# EAGLE board Sequencer-Memory-V2.0 (EAGLE 9.6.2)
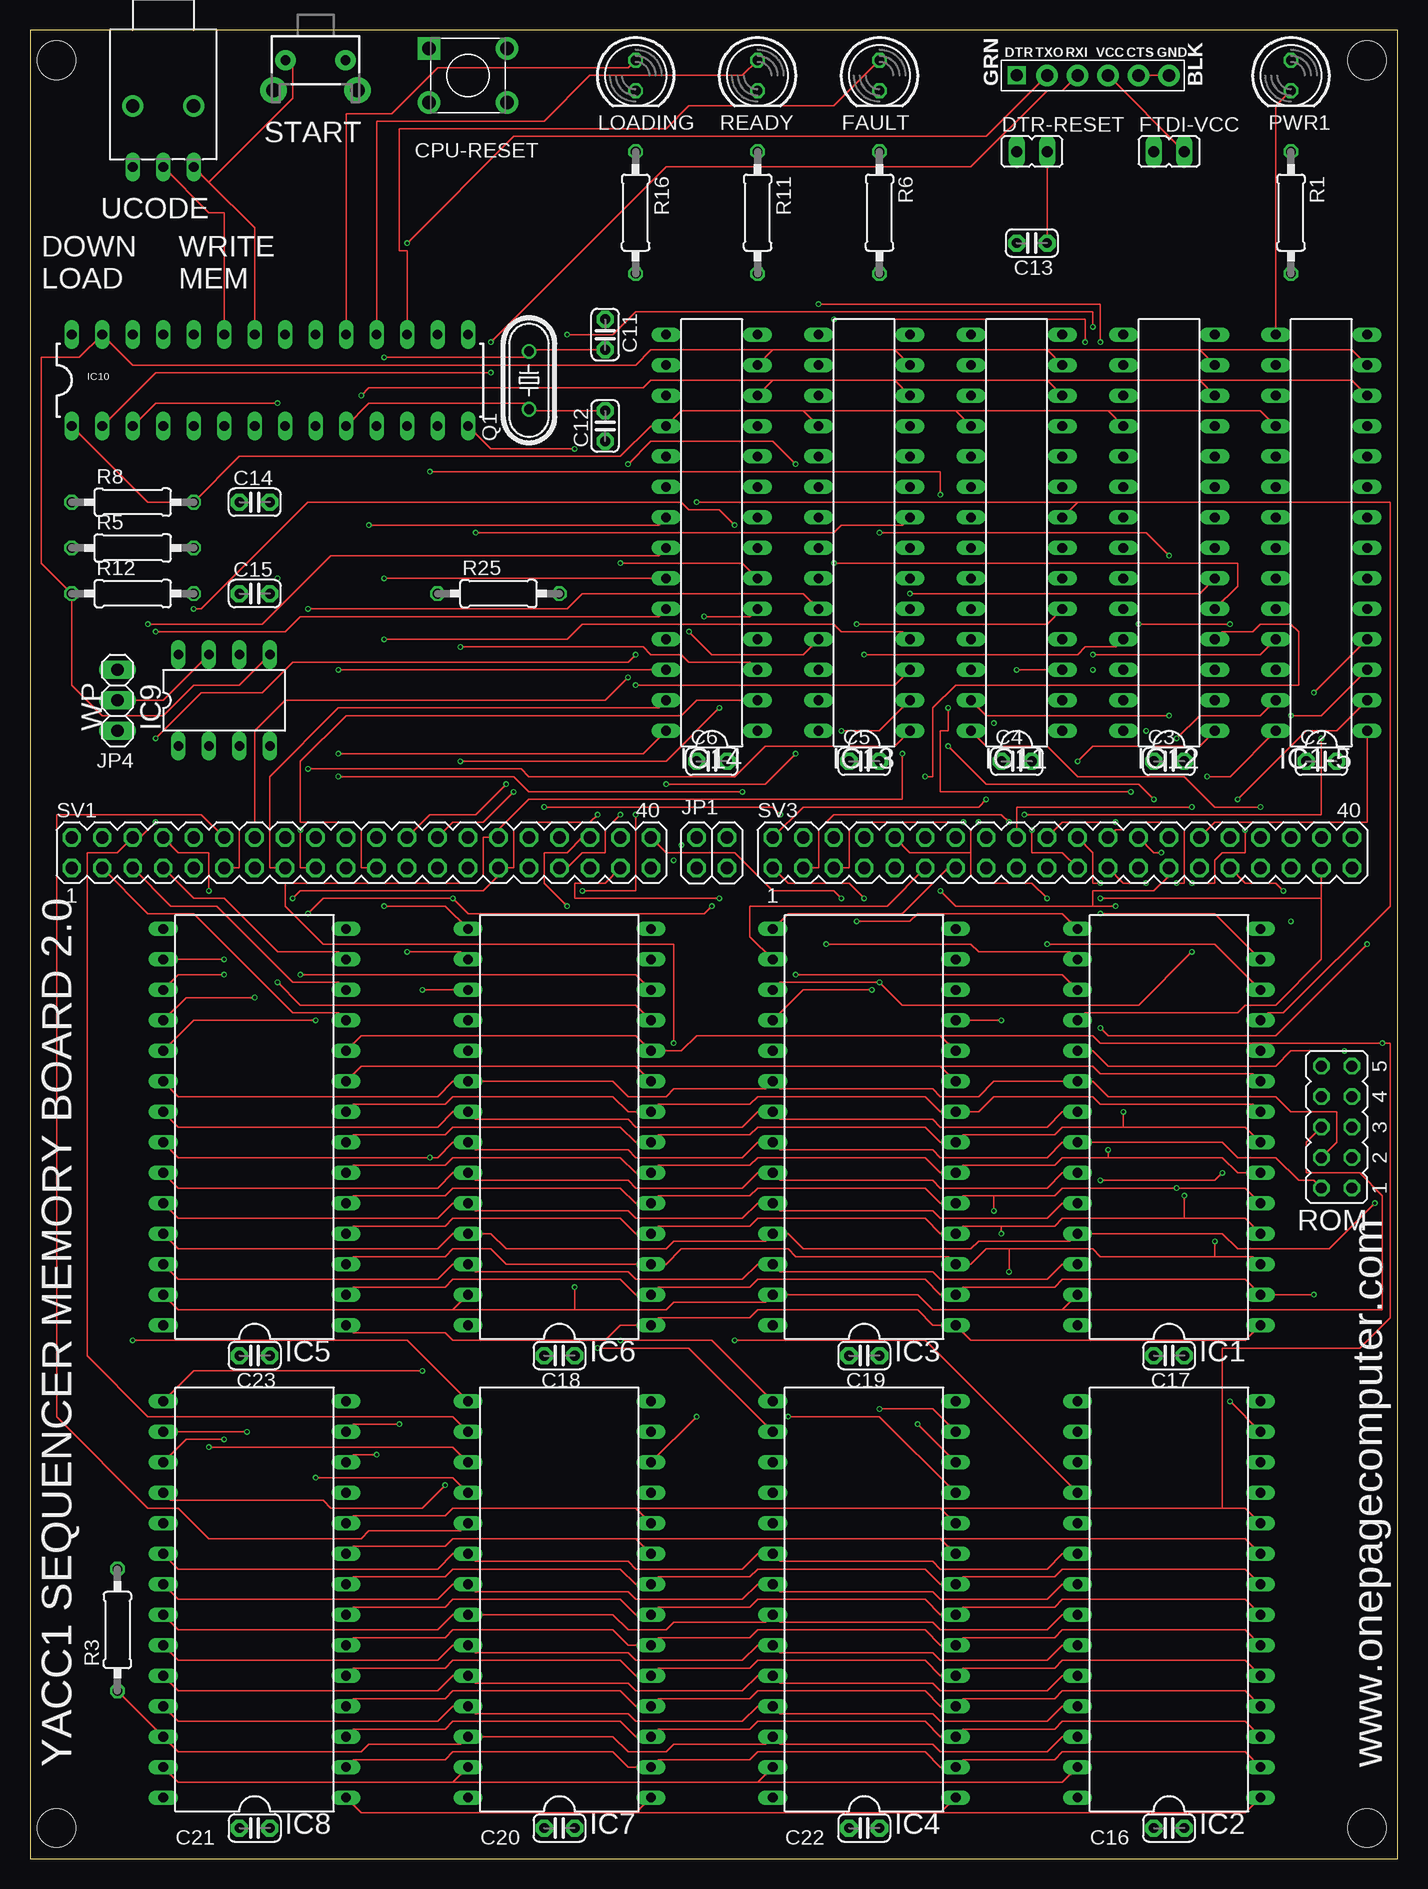
[diagram p4: board, top side]
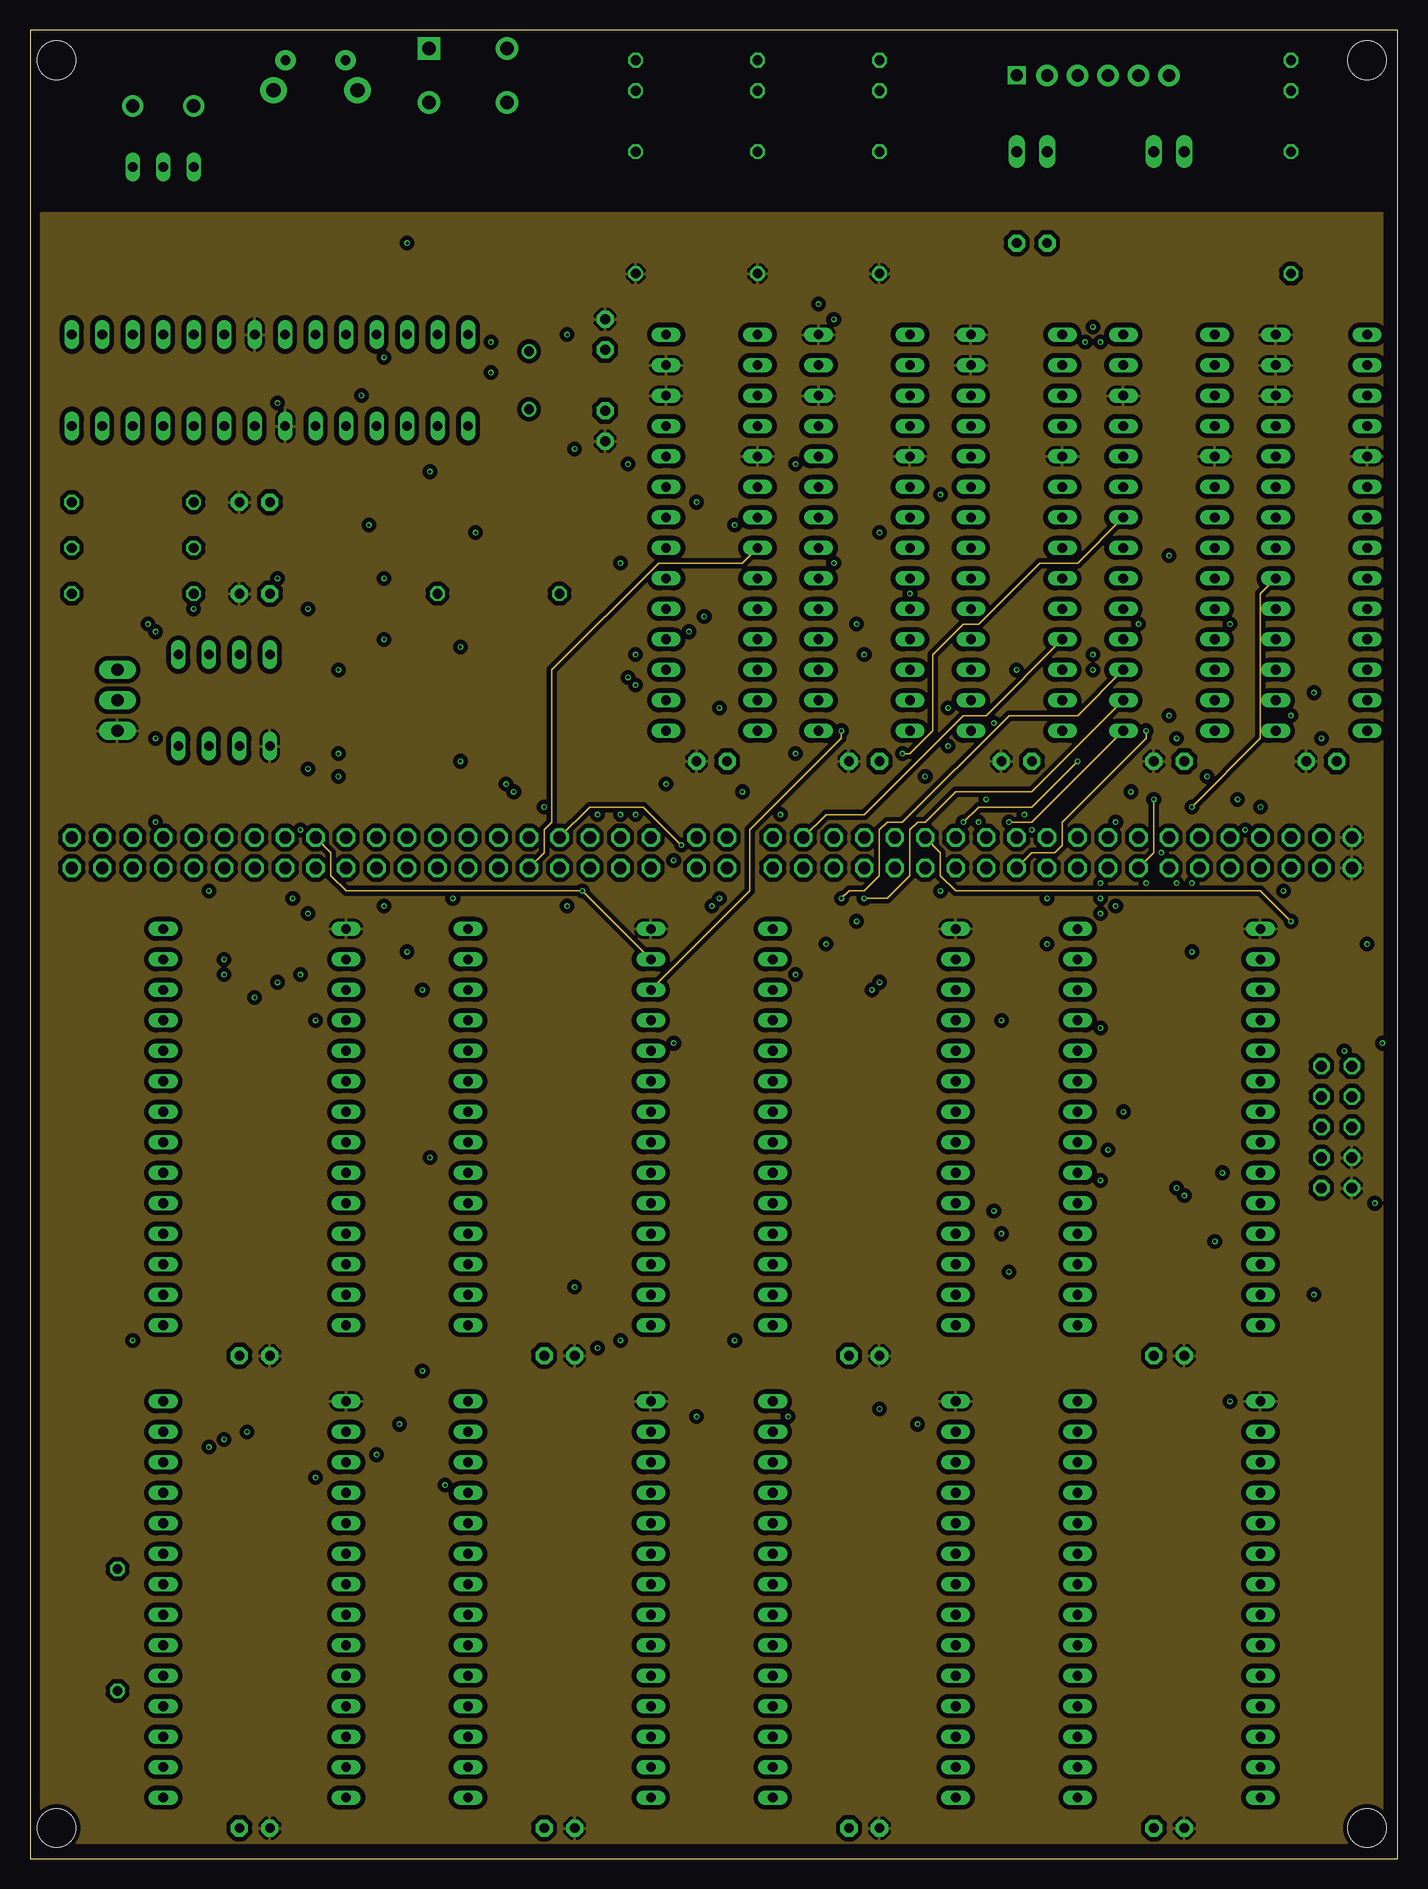
[diagram p5: board, inner layer Route2]
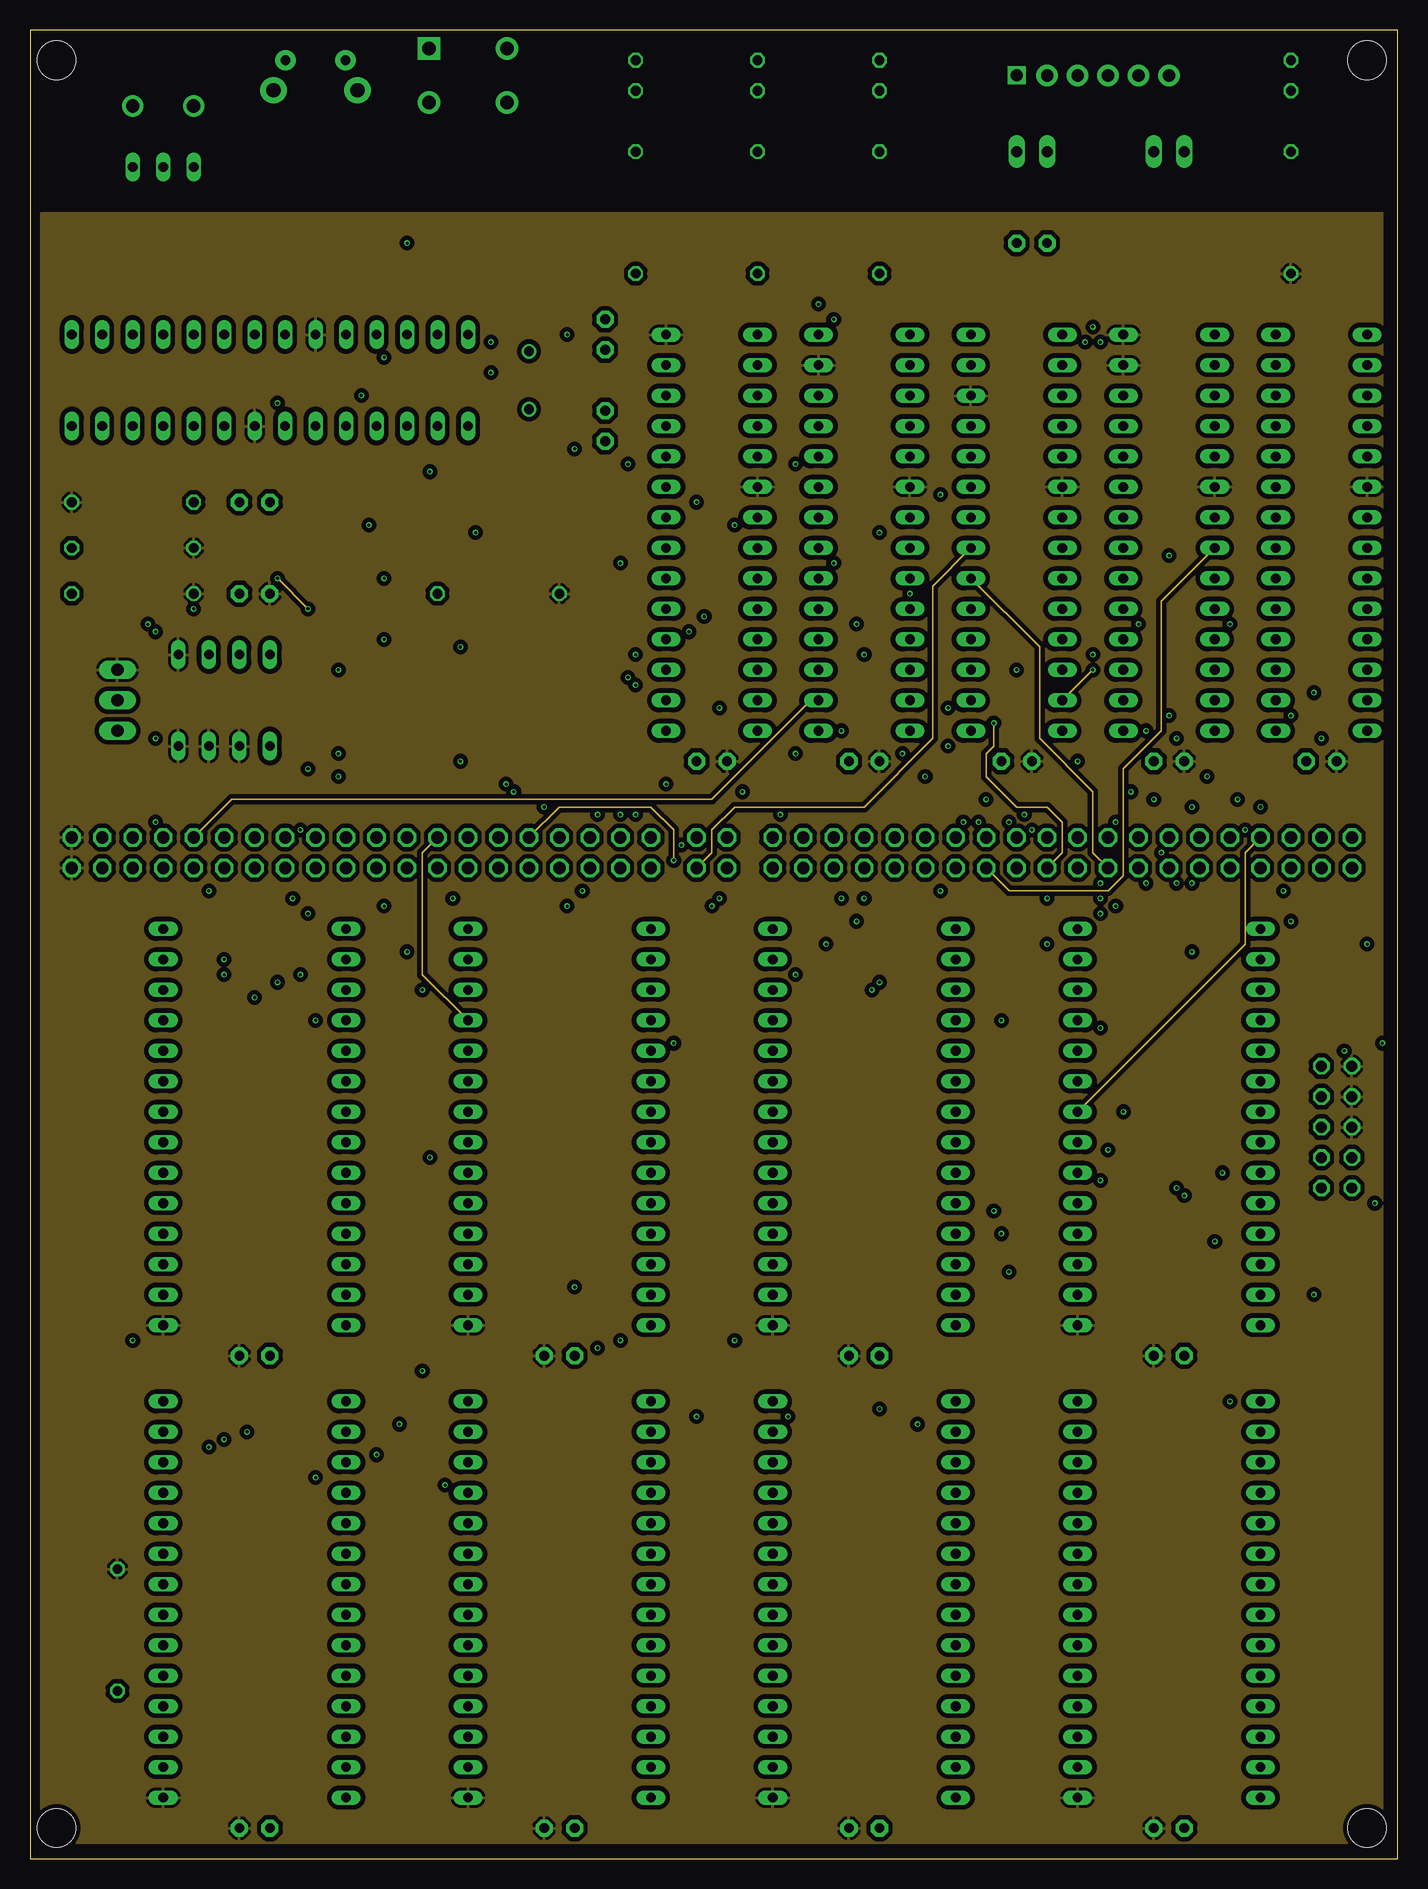
[diagram p6: board, inner layer Route15]
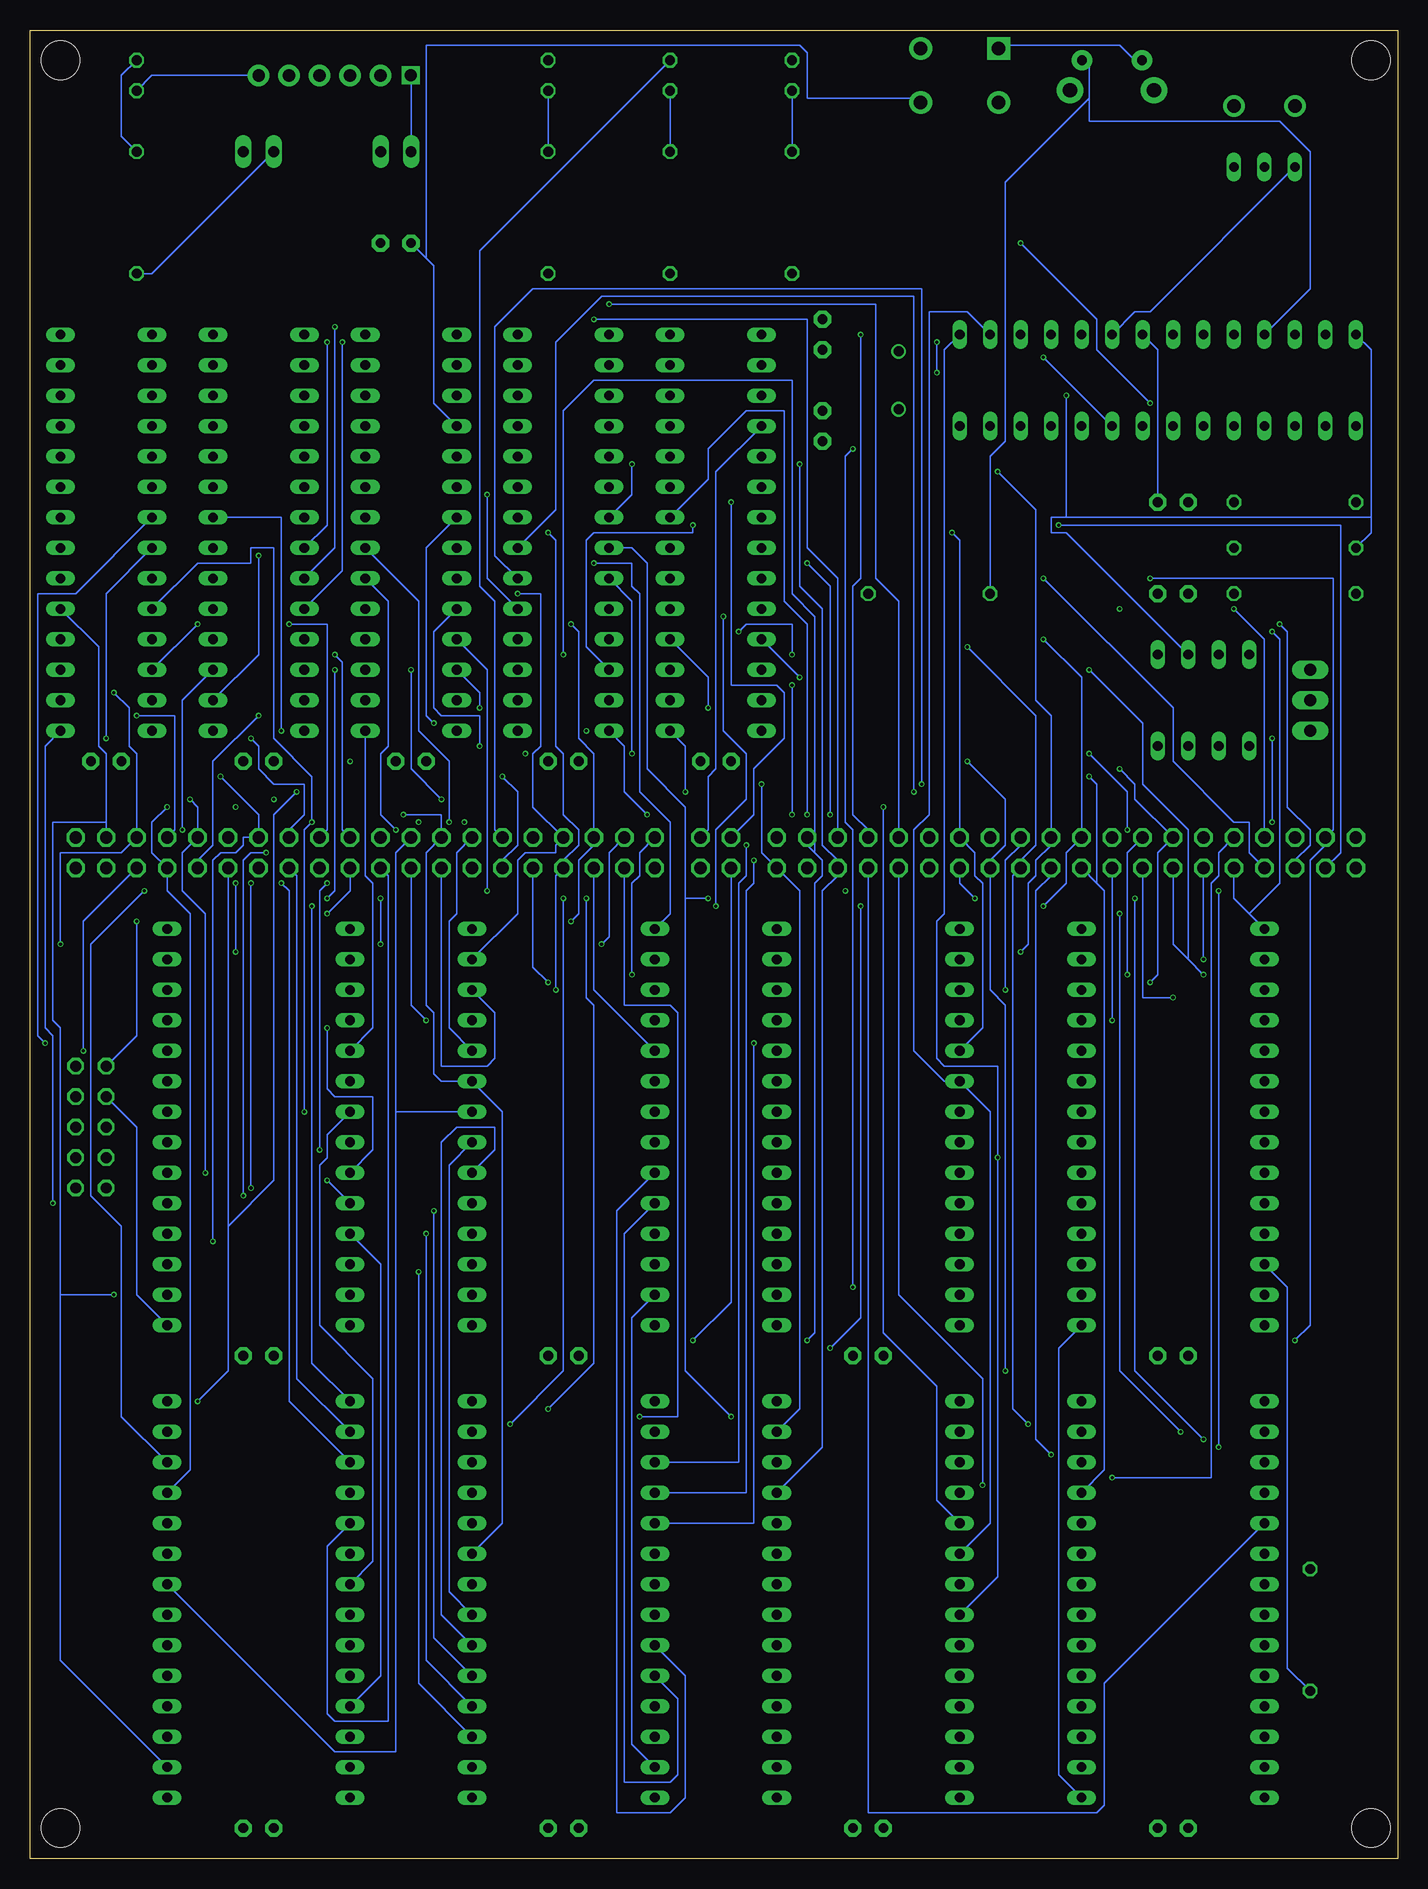
[diagram p7: board, bottom side, seen from below]

Size 113.97 x 152.38 mm. Coordinates in mm from the lower left corner, seen from the top.
Outline: 113.97,0 113.97,152.38 0,152.38 0,0 113.97,0
Copper layers (1*2*15*16): Top 0.035559375mm / dielectric 0.17018125mm / Route2 0.01778125mm / dielectric 47mil / Route15 0.01778125mm / dielectric 0.17018125mm / Bottom 0.035559375mm
Design rules "oshpark-4layer *": minimum track width 5mil, minimum drill 10mil, track to track 15mil, track to pad 10mil, pad to pad 10mil, via to via 5mil, smd to smd 5mil, copper to edge 15mil, drill to drill 6mil, minimum pad ring 4mil, minimum via ring 4mil, stop-mask expansion 2.5mil, vias tented up to drill 0mil, thermal gap 10mil
Holes 3.2 mm at 111.43,2.54 111.43,149.86 2.21,149.86 2.21,2.54

## Footprints (pad centres in the part's own frame; a part is rotated, then mirrored left to right if it is on the bottom)
C025-024X044 = drill 0.813 pad 1.422 octagon: 1 -1.27,0; 2 1.27,0
SW4-6.2X6.2X5.0MM = drill 1.143 pad 1.905 square: 1 -3.25,2.25 | drill 1.143 pad 1.905: 2 -3.25,-2.25; 3 3.25,-2.25; 4 3.25,2.25
JP1 = drill 0.914 long: 1 0,-1.27; 2 0,1.27
LED5MM = drill 0.813 octagon: A -1.27,0; K 1.27,0
DIL28-6 = drill 0.813 long: 1 -16.51,-7.62; 2 -13.97,-7.62; 3 -11.43,-7.62; 4 -8.89,-7.62; 5 -6.35,-7.62; 6 -3.81,-7.62; 7 -1.27,-7.62; 8 1.27,-7.62; 9 3.81,-7.62; 10 6.35,-7.62; 11 8.89,-7.62; 12 11.43,-7.62; 13 13.97,-7.62; 14 16.51,-7.62; 15 16.51,7.62; 16 13.97,7.62; 17 11.43,7.62; 18 8.89,7.62; 19 6.35,7.62; 20 3.81,7.62; 21 1.27,7.62; 22 -1.27,7.62; 23 -3.81,7.62; 24 -6.35,7.62; 25 -8.89,7.62; 26 -11.43,7.62; 27 -13.97,7.62; 28 -16.51,7.62
DIL28-3 = drill 0.813 long: 1 -16.51,-3.81; 2 -13.97,-3.81; 3 -11.43,-3.81; 4 -8.89,-3.81; 5 -6.35,-3.81; 6 -3.81,-3.81; 7 -1.27,-3.81; 8 1.27,-3.81; 9 3.81,-3.81; 10 6.35,-3.81; 11 8.89,-3.81; 12 11.43,-3.81; 13 13.97,-3.81; 14 16.51,-3.81; 15 16.51,3.81; 16 13.97,3.81; 17 11.43,3.81; 18 8.89,3.81; 19 6.35,3.81; 20 3.81,3.81; 21 1.27,3.81; 22 -1.27,3.81; 23 -3.81,3.81; 24 -6.35,3.81; 25 -8.89,3.81; 26 -11.43,3.81; 27 -13.97,3.81; 28 -16.51,3.81
DIL8 = drill 0.813 long: 1 -3.81,-3.81; 2 -1.27,-3.81; 3 1.27,-3.81; 4 3.81,-3.81; 5 3.81,3.81; 6 1.27,3.81; 7 -1.27,3.81; 8 -3.81,3.81
2X02 = drill 1.016 octagon: 1 -1.27,-1.27; 2 -1.27,1.27; 3 1.27,-1.27; 4 1.27,1.27
FTDI_DEVICE_SIDE = drill 1 square: P$1 -6.35,0 | drill 1.016 pad 1.778: P$2 -3.81,0; P$3 -1.27,0; P$4 1.27,0; P$5 3.81,0; P$6 6.35,0
1X03 = drill 1.016 long: 1 -2.54,0; 2 0,0; 3 2.54,0
HC49/S = drill 0.813: 1 -2.413,0; 2 2.413,0
0207/10 = drill 0.813 octagon: 1 -5.08,0; 2 5.08,0
JP5Q = drill 0.914 octagon: 1 -5.08,-1.27; 2 -5.08,1.27; 3 -2.54,-1.27; 4 -2.54,1.27; 5 0,-1.27; 6 0,1.27; 7 2.54,-1.27; 8 2.54,1.27; 9 5.08,-1.27; 10 5.08,1.27
TACTILE-PTH-SIDEEZ = drill 0.8 pad 1.7: 1 -2.5,0; 2 2.5,0 | drill 1.2 pad 2.2: ANCHOR1 -3.5,2.5; ANCHOR2 3.5,2.5
MA20-2 = drill 1.016 octagon: 1 -24.13,-1.27; 2 -24.13,1.27; 3 -21.59,-1.27; 4 -21.59,1.27; 5 -19.05,-1.27; 6 -19.05,1.27; 7 -16.51,-1.27; 8 -16.51,1.27; 9 -13.97,-1.27; 10 -13.97,1.27; 11 -11.43,-1.27; 12 -11.43,1.27; 13 -8.89,-1.27; 14 -8.89,1.27; 15 -6.35,-1.27; 16 -6.35,1.27; 17 -3.81,-1.27; 18 -3.81,1.27; 19 -1.27,-1.27; 20 -1.27,1.27; 21 1.27,-1.27; 22 1.27,1.27; 23 3.81,-1.27; 24 3.81,1.27; 25 6.35,-1.27; 26 6.35,1.27; 27 8.89,-1.27; 28 8.89,1.27; 29 11.43,-1.27; 30 11.43,1.27; 31 13.97,-1.27; 32 13.97,1.27; 33 16.51,-1.27; 34 16.51,1.27; 35 19.05,-1.27; 36 19.05,1.27; 37 21.59,-1.27; 38 21.59,1.27; 39 24.13,-1.27; 40 24.13,1.27
9070-1W = drill 0.813 long: 1 5.08,-2.54; 2 5.08,0; 3 5.08,2.54 | drill 1.118 pad 1.778: B 0,-2.54; B1 0,2.54

## Placement (x,y rotation side)
C2  0.1  [C025-024X044]  107.62,91.44 0 top
C3  0.1  [C025-024X044]  94.92,91.44 0 top
C4  0.1  [C025-024X044]  82.22,91.44 0 top
C5  0.1  [C025-024X044]  69.52,91.44 0 top
C6  0.1  [C025-024X044]  56.82,91.44 0 top
C11  20pf  [C025-024X044]  47.93,127 270 top
C12  20pf  [C025-024X044]  47.93,119.38 90 top
C13  0.1  [C025-024X044]  83.49,134.62 180 top
C14  0.1  [C025-024X044]  18.72,113.03 0 top
C15  0.1  [C025-024X044]  18.72,105.41 0 top
C16  0.1  [C025-024X044]  94.92,2.54 180 top
C17  0.1  [C025-024X044]  94.92,41.91 180 top
C18  0.1  [C025-024X044]  44.12,41.91 180 top
C19  0.1  [C025-024X044]  69.52,41.91 180 top
C20  0.1  [C025-024X044]  44.12,2.54 180 top
C21  0.1  [C025-024X044]  18.72,2.54 180 top
C22  0.1  [C025-024X044]  69.52,2.54 180 top
C23  0.1  [C025-024X044]  18.72,41.91 180 top
CPU-RESET  TS-1109-7  [SW4-6.2X6.2X5.0MM]  36.5,148.59 0 top
DTR-RESET  [JP1]  83.49,142.24 270 top
FAULT  [LED5MM]  70.79,148.59 270 top
FTDI-VCC  [JP1]  94.92,142.24 270 top
IC1  [DIL28-6]  94.92,60.96 90 top
IC1-5  MCP23017SP  [DIL28-3]  107.62,110.49 90 top
IC2  [DIL28-6]  94.92,21.59 90 top
IC3  [DIL28-6]  69.52,60.96 90 top
IC4  [DIL28-6]  69.52,21.59 90 top
IC5  [DIL28-6]  18.72,60.96 90 top
IC6  [DIL28-6]  44.12,60.96 90 top
IC7  [DIL28-6]  44.12,21.59 90 top
IC8  [DIL28-6]  18.72,21.59 90 top
IC9  24AA01P  [DIL8]  16.18,96.52 0 top
IC10  ATMEGA328P_PDIP  [DIL28-3]  19.99,123.19 0 top
IC11  MCP23017SP  [DIL28-3]  82.22,110.49 90 top
IC12  MCP23017SP  [DIL28-3]  94.92,110.49 90 top
IC13  MCP23017SP  [DIL28-3]  69.52,110.49 90 top
IC14  MCP23017SP  [DIL28-3]  56.82,110.49 90 top
JP1  [2X02]  56.82,83.82 0 top
JP3  FTDI_DEVICE  [FTDI_DEVICE_SIDE]  88.57,148.59 0 top
JP4  [1X03]  7.29,96.52 90 top
LOADING  [LED5MM]  50.47,148.59 270 top
PWR1  [LED5MM]  105.08,148.59 270 top
Q1  16Mhz  [HC49/S]  41.58,123.19 90 top
R1  330  [0207/10]  105.08,137.16 270 top
R3  10k  [0207/10]  7.29,19.05 90 top
R5  2.2k  [0207/10]  8.56,109.22 0 top
R6  330  [0207/10]  70.79,137.16 270 top
R8  10k  [0207/10]  8.56,113.03 0 top
R11  330  [0207/10]  60.63,137.16 270 top
R12  2.2k  [0207/10]  8.56,105.41 0 top
R16  330  [0207/10]  50.47,137.16 270 top
R25  10k  [0207/10]  39.04,105.41 0 top
READY  [LED5MM]  60.63,148.59 270 top
ROM  [JP5Q]  108.89,60.96 90 top
START  SWITCH-MOMENTARY-2SIDE_EZ  [TACTILE-PTH-SIDEEZ]  23.8,149.86 180 top
SV1  [MA20-2]  27.61,83.82 0 top
SV3  [MA20-2]  86.03,83.82 0 top
UCODE  [9070-1W]  11.1,146.05 270 top

## Tracks (layer width: path | path; a pad name or v marks a point on that pad's centre or on a via)
-2-BYTE-OPERAND-SEL  (via drill 0.25)
  Top 0.127: IC1.12 98.73,76.2 v84.76,76.2 | v84.76,80.01 83.49,81.28 79.05,81.28 78.41,81.92 78.41,83.82 | 78.41,83.82 73.33,83.82 SV3.10 | v79.05,86.36 78.41,85.72 78.41,83.82
  Bottom 0.127: v84.76,80.01 v84.76,76.2 | IC11.7 81.59,104.78 81.59,93.98 79.05,91.44 v79.05,86.36
-AC-LD  (via drill 0.25)
  Top 0.127: IC3.18 64.44,72.39 v70.16,72.39 | v94.92,108.58 93.02,110.49 v70.79,110.49
  Bottom 0.127: v70.16,72.39 70.16,81.92 SV3.7 69.52,83.19 68.25,84.45 68.25,85.72 69.52,87 69.52,92.08 70.16,92.71 70.16,109.86 v70.79,110.49 | IC12.2 94.92,100.33 v94.92,108.58
-AC-LD-INV  (via drill 0.25)
  Top 0.127: IC4.11 70.79,36.83 v63.17,36.83 | v81.59,86.36 80.95,87 66.98,87 65.71,85.72 65.71,82.55 SV3.3
  Route2 0.127: IC12.28 83.49,86.36 v81.59,86.36
  Bottom 0.127: v63.17,36.83 60,36.83 60,70.48 60.63,71.12 64.44,71.12 SV3.3
-AC-RD  (via drill 0.25)
  Top 0.127: IC12.1 97.46,92.71 88.57,92.71 v87.3,91.44 | v77.78,86.36 68.89,86.36 68.25,85.72 68.25,82.55 SV3.5
  Route2 0.127: v87.3,91.44 83.49,87.63 79.05,87.63 v77.78,86.36
  Bottom 0.127: IC3.19 66.98,72.39 SV3.5
-ADDR-REG-LD0  (via drill 0.25)
  Top 0.127: IC6.12 50.47,73.66 v22.53,73.66 | IC13.2 70.79,93.98 v67.61,93.98
  Route2 0.127: v67.61,93.98 67.61,93.34 60,85.72 60,80.64 IC6.12
  Bottom 0.127: v22.53,73.66 22.53,83.82 SV1.16
-ADDR-REG-LD1  (via drill 0.25)
  Top 0.127: IC6.15 34.59,79.38 v29.52,79.38 | IC13.4 72.7,102.23 67.61,102.23 66.98,102.87 46.02,102.87 44.76,101.6 v29.52,101.6
  Bottom 0.127: v29.52,79.38 27.61,81.28 27.61,83.82 SV1.20 26.34,98.42 v29.52,101.6
-ADDR-REG-RD0  (via drill 0.25)
  Top 0.127: IC6.11 50.47,71.12 22.53,71.12 v20.62,73.03 | IC13.1 72.06,92.71 61.27,92.71 58.73,90.17 41.58,90.17 40.95,90.81 v23.17,90.81
  Bottom 0.127: v20.62,73.03 19.99,73.66 19.99,83.82 SV1.14 21.9,88.27 21.9,89.53 v23.17,90.81
-ADDR-REG-RD1  (via drill 0.25)
  Top 0.127: IC13.3 72.06,97.79 v50.47,97.79 | v50.47,87 50.47,80.64 v46.02,80.64
  Route2 0.127: IC6.13 v46.02,80.64 26.34,80.64 25.07,81.92 25.07,83.82 SV1.18
  Bottom 0.127: v50.47,87 v50.47,97.79
-ALU-FUNC  (via drill 0.25)
  Top 0.127: v88.57,127.64 88.57,128.91 50.47,128.91 48.57,127 v44.76,127
  Route2 0.127: v54.28,84.45 51.11,87.63 46.66,87.63 SV1.34
  Bottom 0.127: IC4.17 54.91,33.02 54.91,81.28 54.28,81.92 v54.28,84.45 | IC12.23 88.57,109.22 v88.57,127.64 | v44.76,127 44.76,106.68 45.39,106.05 45.39,87 44.12,85.72 SV1.34
-BRANCH-RD-HI  (via drill 0.25)
  Top 0.127: IC1.17 86.03,73.66 v63.81,73.66 | v82.22,99.06 IC11.3 | v79.68,88.27 79.05,87.63 64.44,87.63 SV3.2
  Bottom 0.127: v63.81,73.66 63.81,81.28 63.17,81.92 63.17,83.82 SV3.2 | v82.22,99.06 82.22,90.81 v79.68,88.27
-BRANCH-RD-LO  (via drill 0.25)
  Top 0.127: v109.53,67.31 105.08,67.31 103.81,66.04 89.84,66.04 88.57,67.31 IC1.19
  Bottom 0.127: IC1.19 85.39,69.22 85.39,81.28 86.03,81.92 IC11.1 | SV3.35 109.53,78.11 v109.53,67.31
-CMEMRD  (via drill 0.25)
  Top 0.127: IC5.22 12.37,58.42 v33.33,58.42 33.96,58.42 35.23,59.69 IC6.22 37.14,59.05 49.84,59.05 50.47,58.42 59.36,58.42 60.63,59.69 IC3.22 62.54,59.05 75.23,59.05 75.87,58.42 84.76,58.42 86.03,59.69 IC1.22 99.36,59.69 100.64,58.42 103.81,58.42 105.72,56.52 106.98,56.52 ROM.2 | IC2.22 86.03,20.32 84.76,19.05 75.87,19.05 75.23,19.68 62.54,19.68 IC4.22 61.27,19.68 53.65,19.68 53.01,19.05 49.84,19.05 48.57,20.32 IC7.22 35.23,20.32 33.96,19.05 12.37,19.05 IC8.22
  Bottom 0.127: IC10.15 37.77,125.73 37.77,78.74 38.41,78.11 38.41,66.67 37.77,66.04 33.33,66.04 v33.33,58.42 33.33,23.5 IC7.22
-CMEMSEL
  Top 0.127: IC8.20 12.37,24.13 33.96,24.13 35.23,25.4 IC7.20 37.14,24.77 49.84,24.77 50.47,24.13 59.36,24.13 60.63,25.4 IC4.20 62.54,24.77 75.23,24.77 75.87,24.13 84.76,24.13 86.03,25.4 IC2.20 | ROM.4 108.89,59.69 108.89,62.23 105.08,62.23 103.81,63.5 89.84,63.5 88.57,64.77 IC1.20 80.31,64.77 79.05,63.5 75.87,63.5 75.23,64.14 62.54,64.14 IC3.20 61.27,64.14 53.65,64.14 53.01,63.5 49.84,63.5 48.57,64.77 IC6.20 35.23,64.77 33.96,63.5 12.37,63.5 IC5.20
  Bottom 0.127: IC10.16 35.87,128.91 39.04,128.91 39.04,87 40.31,85.72 40.31,67.31 37.77,64.77 IC6.20 33.96,62.23 33.96,27.94 IC7.20
-CMEMWR  (via drill 0.25)
  Top 0.127: IC8.27 12.37,6.35 35.23,6.35 | IC7.27 35.23,6.35 | 60.63,6.35 IC4.27 | 35.23,6.35 60.63,6.35 | IC2.27 86.03,6.35 60.63,6.35 | IC5.27 12.37,45.72 35.23,45.72 | IC6.27 35.23,45.72 | 35.23,45.72 45.39,45.72 | 45.39,45.72 53.01,45.72 53.65,46.35 61.27,46.35 IC3.27 73.97,46.99 75.23,45.72 86.03,45.72 | 86.03,45.72 IC1.27 | IC10.14 38.41,117.47 v45.39,117.47 | 45.39,45.72 v45.39,47.62 | ROM.6 106.35,59.69 106.35,57.15 110.8,57.15 112.7,55.24 112.7,45.72 86.03,45.72
  Bottom 0.127: v45.39,117.47 46.02,116.84 46.02,86.36 45.39,85.72 v45.39,47.62 | IC4.27 63.81,9.53 63.81,45.09 IC3.27
-HL-SWAP  (via drill 0.25)
  Top 0.127: IC3.15 63.17,78.74 72.7,78.74 76.5,82.55 SV3.13 | IC12.5 100.64,106.05 100.64,107.95 v66.98,107.95
  Bottom 0.127: v66.98,107.95 63.81,107.95 63.81,106.05 63.17,105.41 63.17,88.9 60.63,86.36 60.63,78.74 IC3.15
-INT-JMP  (via drill 0.25)
  Top 0.127: IC1.15 86.03,78.74 73.97,78.74 73.33,78.11 v68.89,78.11 | IC11.5 84.76,102.87 v68.89,102.87
  Bottom 0.127: v68.89,78.11 68.25,78.74 68.25,83.19 66.98,84.45 SV3.6 66.98,92.08 68.25,93.34 68.25,102.23 v68.89,102.87
-INTA  (via drill 0.25)
  Route15 0.127: v80.31,94.61 80.31,92.71 79.68,92.08 79.68,90.17 82.22,87.63 84.76,87.63 86.03,86.36 86.03,83.82 SV3.19
  Bottom 0.127: IC2.19 89.2,26.04 89.2,12.06 88.57,11.43 84.12,11.43 84.12,81.92 SV3.19 | IC11.21 80.95,109.22 80.95,95.25 v80.31,94.61
-IO-ADDR-LD  (via drill 0.25)
  Top 0.127: v53.65,67.94 53.65,76.2 24.44,76.2 21.26,79.38 21.26,81.28 37.14,81.28 37.77,81.92 37.77,85.09 38.41,85.09 | v72.7,92.08 72.7,88.27 41.58,88.27 38.41,85.09 | 38.41,85.09 SV1.30
  Route2 0.127: IC12.21 87.3,107.95 84.12,107.95 79.05,102.87 77.78,102.87 75.23,100.33 75.23,93.98 73.33,92.08 v72.7,92.08
  Bottom 0.127: IC4.19 53.65,27.94 v53.65,67.94
-IO-RD  (via drill 0.25)
  Top 0.127: v63.81,92.08 61.27,89.53 v53.01,89.53
  Bottom 0.127: IC7.13 49.84,37.47 49.84,80.64 SV1.39 53.01,83.82 v53.01,89.53 | IC13.23 63.81,104.78 v63.81,92.08
-IO-WR  (via drill 0.25)
  Top 0.127: IC7.15 31.42,43.18 v8.56,43.18 | IC13.24 64.44,105.41 46.02,105.41 44.76,104.14 v23.17,104.14
  Route15 0.127: v20.62,106.68 v23.17,104.14
  Bottom 0.127: v8.56,43.18 7.29,44.45 7.29,83.19 6.02,84.45 SV1.4 5.38,85.72 5.38,106.68 v20.62,106.68
-MEM-CPU-RESET
  Top 0.127: IC10.1 9.83,113.03 R8.2 17.45,116.84 49.2,116.84 51.74,119.38 IC14.18 54.28,120.65 64.44,120.65 | IC13.18 64.44,120.65 | 77.14,120.65 IC11.18 | 64.44,120.65 77.14,120.65 | 89.84,120.65 IC12.18 | 77.14,120.65 89.84,120.65 | IC1-5.18 102.54,120.65 89.84,120.65
  Bottom 0.127: 80.95,133.35 80.31,132.72 80.31,121.28 IC11.18 | 80.95,133.35 C13.2 | JP1.4 57.45,85.72 57.45,90.17 56.82,90.81 56.82,115.57 IC14.18 | 80.95,133.35 80.95,151.13 49.84,151.13 49.2,150.5 49.2,146.69 40.31,146.69 CPU-RESET.3
-MEM-RD  (via drill 0.25)
  Top 0.127: v63.81,116.2 61.9,118.11 51.74,118.11 v49.84,116.2
  Bottom 0.127: IC7.11 47.93,34.29 47.93,80.64 46.66,81.92 SV1.35 46.66,83.19 47.93,84.45 47.93,104.14 49.84,106.05 v49.84,116.2 | IC13.21 63.81,113.67 v63.81,116.2
-MEM-WR  (via drill 0.25)
  Top 0.127: v55.55,36.83 IC7.12 | SV1.37 47.93,81.28 45.39,81.28 45.39,80.01 v57.45,80.01
  Bottom 0.127: v55.55,36.83 59.36,40.64 59.36,80.01 | 59.36,80.01 59.36,87.63 62.54,90.81 62.54,107.95 63.81,109.22 IC13.22 | 59.36,80.01 v57.45,80.01
-REG-DN  (via drill 0.25)
  Top 0.127: IC8.18 11.73,29.84 24.44,29.84 25.07,29.21 32.69,29.21 v34.59,31.11
  Route2 0.127: IC14.7 59.36,107.95 52.38,107.95 43.48,99.06 43.48,86.36 42.85,85.72 42.85,83.82 SV1.31
  Bottom 0.127: v34.59,31.11 34.59,40.01 41.58,46.99 SV1.31
-REG-FUNC-LD  (via drill 0.25)
  Top 0.127: IC5.12 25.71,73.03 21.9,73.03 15.54,79.38 11.73,79.38 SV1.5 | IC14.22 52.38,108.58 25.07,108.58 19.36,102.87 v9.83,102.87
  Bottom 0.127: v9.83,102.87 9.2,102.23 9.2,87.63 7.29,85.72 7.29,84.45 8.56,83.19 SV1.5
-REG-FUNC-RD  (via drill 0.25)
  Top 0.127: IC5.11 25.71,70.48 21.9,70.48 13.64,78.74 9.83,78.74 SV1.3 | IC14.21 52.38,111.12 v28.25,111.12
  Bottom 0.127: v28.25,111.12 4.75,111.12 4.75,83.82 SV1.3
-REG-LD-HI  (via drill 0.25)
  Top 0.127: IC8.17 13.01,34.92 v16.18,34.92 | v21.9,80.01 22.53,80.64 37.77,80.64 39.04,81.92 SV1.29 40.31,82.55 40.31,85.72 40.95,86.36 46.66,86.36 v47.3,87 | IC14.6 59.36,107.95 v49.2,107.95
  Bottom 0.127: v16.18,34.92 21.9,40.64 v21.9,80.01 | v49.2,107.95 47.3,106.05 v47.3,87
-REG-LD-LO  (via drill 0.25)
  Top 0.127: IC8.15 13.64,40.64 v32.69,40.64 | v57.45,95.89 53.01,91.44 v35.87,91.44
  Bottom 0.127: v32.69,40.64 32.69,71.12 33.96,72.39 SV1.25 33.96,83.19 32.69,84.45 32.69,88.27 v35.87,91.44 | IC14.4 57.45,98.42 v57.45,95.89
-REG-RD-HI  (via drill 0.25)
  Top 0.127: v18.09,35.56 IC8.16 | v23.17,78.74 24.44,80.01 v35.23,80.01 36.5,78.74 56.19,78.74 v56.82,79.38 | IC14.5 60,103.5 v56.19,103.5
  Bottom 0.127: v18.09,35.56 23.17,40.64 v23.17,78.74 | v35.23,80.01 36.5,81.28 SV1.27 | v56.19,103.5 56.19,93.98 54.28,92.08 54.28,88.27 56.82,85.72 v56.82,79.38
-REG-RD-LO  (via drill 0.25)
  Top 0.127: IC8.13 26.98,36.2 v30.79,36.2 | IC14.3 60,99.69 54.91,99.69 54.28,100.33 51.74,100.33 51.11,100.97 v35.87,100.97
  Bottom 0.127: v30.79,36.2 32.05,37.47 32.05,81.92 SV1.23 31.42,83.19 30.15,84.45 30.15,95.25 v35.87,100.97
-REG-UP  (via drill 0.25)
  Top 0.127: v49.2,87 47.93,85.72 47.93,83.82 46.02,83.82 44.76,82.55 SV1.33
  Bottom 0.127: IC8.19 24.44,14.61 24.44,4.45 25.07,3.81 44.12,3.81 SV1.33 | IC14.8 57.45,114.94 57.45,117.47 54.28,120.65 51.11,120.65 51.11,104.78 49.2,102.87 v49.2,87
-SR-LD  (via drill 0.25)
  Top 0.127: IC3.17 62.54,73.03 v70.79,73.03 72.7,71.12 92.38,71.12 v96.83,75.56 | v101.27,85.72 101.27,83.82 99.36,83.82 98.73,83.19 98.73,81.28 v96.83,81.28
  Bottom 0.127: v70.79,73.03 72.06,74.3 SV3.9 | IC12.3 101.27,96.52 v101.27,85.72 | v96.83,75.56 v96.83,81.28
-TMP-REG-LD0  (via drill 0.25)
  Top 0.127: IC7.17 35.23,34.29 v14.91,34.29 | v14.91,80.64 14.91,83.82 12.37,83.82 SV1.8 | v58.73,111.12 57.45,112.39 54.91,112.39 54.28,113.03 23.17,113.03 14.28,104.14 v13.64,104.14
  Bottom 0.127: v14.91,80.64 v14.91,34.29 | IC13.26 67.61,100.97 67.61,109.86 66.98,110.49 58.73,110.49 v58.73,111.12 | v13.64,104.14 11.1,101.6 SV1.8
-TMP-REG-LD1  (via drill 0.25)
  Top 0.127: IC7.19 35.87,27.3 28.25,27.3 27.61,26.67 14.91,26.67 12.37,29.21 9.83,29.21 2.21,36.83 2.21,87 14.28,87 SV1.12 | v62.54,87 61.9,87.63 v42.85,87.63
  Bottom 0.127: IC13.28 64.44,92.71 64.44,88.9 v62.54,87 | v42.85,87.63 42.85,43.81 38.41,39.37 38.41,29.84 IC7.19
-TMP-REG-RD0  (via drill 0.25)
  Top 0.127: IC7.16 35.23,36.83 9.83,36.83 4.75,41.91 4.75,83.82 7.29,83.82 SV1.6 9.2,85.09 v10.46,86.36 | IC13.25 64.44,100.33 56.82,100.33 v54.91,102.23 | v50.47,100.33 49.84,99.69 21.9,99.69 19.36,97.16 14.28,97.16 v10.46,93.34
  Bottom 0.127: v54.91,102.23 54.28,102.87 50.47,102.87 v50.47,100.33 | v10.46,86.36 v10.46,93.34
-TMP-REG-RD1  (via drill 0.25)
  Top 0.127: IC7.18 35.23,31.75 v23.8,31.75
  Route15 0.127: IC13.27 65.08,96.52 56.82,88.27 16.82,88.27 SV1.10
  Bottom 0.127: v23.8,31.75 15.54,31.75 15.54,81.28 14.91,81.92 14.91,83.82 SV1.10
-VMA  (via drill 0.25)
  Top 0.127: v89.2,126.36 89.2,129.54 v65.71,129.54
  Route15 0.127: v53.65,83.19 53.65,85.72 51.74,87.63 44.12,87.63 SV1.32
  Bottom 0.127: IC4.18 54.28,30.48 54.28,80.64 53.65,81.28 v53.65,83.19 | IC12.22 89.2,111.12 v89.2,126.36 | v65.71,129.54 43.48,129.54 43.48,106.68 41.58,104.78 SV1.32
ALU0  (via drill 0.25)
  Top 0.127: IC4.16 54.91,42.55 v47.3,42.55 | v44.76,79.38 42.85,81.28 42.85,83.82 44.76,83.82 46.02,85.09 SV1.36 | v87.94,126.36 87.94,128.27 v66.98,128.27
  Bottom 0.127: v47.3,42.55 44.76,45.09 v44.76,79.38 | IC12.24 87.94,107.31 v87.94,126.36 | v66.98,128.27 49.2,128.27 49.2,109.22 46.66,106.68 SV1.36
ALU1  (via drill 0.25)
  Top 0.127: IC4.15 56.82,43.18 v49.2,43.18 | IC12.25 90.48,100.97 87.94,100.97 87.3,100.33 v69.52,100.33
  Bottom 0.127: v49.2,43.18 48.57,43.81 48.57,81.28 47.93,81.92 47.93,83.19 48.57,83.82 | 48.57,83.82 49.2,84.45 SV1.38 | v69.52,100.33 69.52,120.65 66.98,123.19 50.47,123.19 50.47,105.41 48.57,103.5 48.57,83.82
ALU2  (via drill 0.25)
  Top 0.127: IC4.13 75.23,37.47 v70.79,37.47 | v67.61,80.01 66.98,80.64 61.9,80.64 58.73,83.82 53.01,83.82 SV1.40
  Route2 0.127: IC12.26 87.3,95.25 81.59,95.25 72.7,86.36 71.42,86.36 70.79,85.72 70.79,81.92 69.52,80.64 68.25,80.64 v67.61,80.01
  Bottom 0.127: v70.79,37.47 66.98,41.27 66.98,71.12 67.61,71.75 v67.61,80.01
ALU3  (via drill 0.25)
  Top 0.127: v73.97,36.2 IC4.12 | v69.52,80.01 68.25,81.28 63.17,81.28 SV3.1
  Route2 0.127: IC12.27 83.49,88.9 77.14,88.9 74.6,86.36 73.97,86.36 73.33,85.72 73.33,81.92 71.42,80.01 v69.52,80.01
  Bottom 0.127: v73.97,36.2 69.52,40.64 v69.52,80.01
ARD-RXIN  (via drill 0.25)
  Top 0.127: IC10.2 10.46,123.83 v38.41,123.83 | v38.41,126.36 53.01,140.97 78.41,140.97 84.76,147.32 86.03,147.32 JP3.P$3
  Bottom 0.127: v38.41,126.36 v38.41,123.83
ARD-TXOUT  (via drill 0.25)
  Top 0.127: IC10.3 10.46,121.28 v20.62,121.28 | v31.42,134.62 40.31,143.51 79.68,143.51 JP3.P$2
  Bottom 0.127: v20.62,121.28 25.07,125.73 25.07,128.27 v31.42,134.62
BR-TEST  (via drill 0.25)
  Top 0.127: IC3.16 60,76.83 60,79.38 71.42,79.38 SV3.11 | IC12.4 99.36,102.23 101.91,102.23 102.54,102.87 105.08,102.87 105.72,102.23 105.72,97.79 77.14,97.79 75.23,95.89 75.23,90.17 v74.6,90.17
  Bottom 0.127: v74.6,90.17 73.33,88.9 73.33,84.45 74.6,83.19 SV3.11
BRANCH-LD-HI  (via drill 0.25)
  Top 0.127: IC1.16 86.67,75.56 79.05,75.56 78.41,76.2 v66.34,76.2
  Route2 0.127: IC11.4 79.68,95.25 77.78,95.25 69.52,87 66.34,87 SV3.4
  Bottom 0.127: v66.34,76.2 65.71,76.83 65.71,83.82 SV3.4
BRANCH-LD-LO  (via drill 0.25)
  Top 0.127: IC1.18 87.94,70.48 100.64,70.48 101.27,71.12 103.81,71.12 107.62,74.93 107.62,80.01 | SV3.37 107.62,80.01 | 107.62,80.01 v89.2,80.01
  Route15 0.127: v88.57,99.06 IC11.2
  Bottom 0.127: v88.57,99.06 88.57,80.64 v89.2,80.01
CADDR0  (via drill 0.25)
  Top 0.127: IC8.10 26.98,28.57 34.59,28.57 35.23,29.21 50.47,29.21 | IC7.10 50.47,29.21 | 75.87,29.21 IC4.10 | 50.47,29.21 75.87,29.21 | IC2.10 101.27,29.21 99.36,29.21 | 75.87,29.21 99.36,29.21 | IC5.10 27.61,68.58 50.47,68.58 IC6.10 54.28,67.31 55.55,68.58 75.87,68.58 | 75.87,68.58 IC3.10 | 101.91,67.94 IC1.10 | 101.91,67.94 89.2,67.94 88.57,68.58 75.87,68.58 | 101.91,67.94 v112.7,67.94 113.34,67.94 113.34,45.09 110.8,42.55 99.36,42.55 99.36,29.21
  Bottom 0.127: IC1-5.21 110.16,105.41 113.34,105.41 113.34,68.58 v112.7,67.94 | SV3.14 78.41,83.82 78.41,78.74 79.05,78.11 79.05,69.22 IC3.10
CADDR1  (via drill 0.25)
  Top 0.127: IC8.9 26.98,26.04 34.59,26.04 35.23,26.67 50.47,26.67 | IC7.9 50.47,26.67 | 75.87,26.67 IC4.9 | 50.47,26.67 75.87,26.67 | IC2.9 101.27,26.67 75.87,26.67 | v107.62,93.34 107.62,87 v82.86,87 | IC5.9 27.61,66.04 50.47,66.04 | IC6.9 50.47,66.04 | 75.87,66.04 IC3.9 | 50.47,66.04 75.87,66.04 | IC1.9 101.91,65.41 89.2,65.41 88.57,66.04 75.87,66.04
  Bottom 0.127: IC1-5.22 107.62,105.41 v107.62,93.34 | v82.86,87 79.68,87 SV3.16 80.95,83.82 80.95,71.12 80.31,70.48 80.31,65.41 79.68,64.77 IC3.9 74.6,62.23 74.6,27.94 IC4.9
CADDR2  (via drill 0.25)
  Top 0.127: IC8.8 26.98,23.5 34.59,23.5 35.23,24.13 49.2,24.13 50.47,22.86 IC7.8 52.38,23.5 60,23.5 60.63,24.13 74.6,24.13 75.87,22.86 IC4.8 77.78,23.5 85.39,23.5 86.03,24.13 101.27,24.13 IC2.8 | IC5.8 26.98,62.87 34.59,62.87 35.23,63.5 48.57,63.5 49.84,62.23 IC6.8 52.38,62.87 60,62.87 60.63,63.5 74.6,63.5 75.87,62.23 IC3.8 79.05,62.23 80.31,63.5 88.57,63.5 89.2,62.87 101.91,62.87 IC1.8 | v96.83,87.63 82.22,87.63 SV3.18
  Route2 0.127: IC1-5.23 102.54,105.41 102.54,93.34 v96.83,87.63
  Bottom 0.127: 83.49,62.23 IC3.8 | 83.49,62.23 83.49,83.82 SV3.18 | IC2.8 88.57,8.89 83.49,8.89 83.49,62.23
CADDR3  (via drill 0.25)
  Top 0.127: IC8.7 26.98,20.95 34.59,20.95 35.23,21.59 49.2,21.59 50.47,20.32 IC7.7 52.38,20.95 60,20.95 60.63,21.59 74.6,21.59 75.87,20.32 IC4.7 77.78,20.95 85.39,20.95 86.03,21.59 101.27,21.59 IC2.7 | v90.48,86.36 86.03,86.36 SV3.20 | IC5.7 26.98,60.33 34.59,60.33 35.23,60.96 49.2,60.96 50.47,59.69 IC6.7 52.38,60.33 60,60.33 60.63,60.96 74.6,60.96 75.87,59.69 IC3.7 77.78,60.33 85.39,60.33 86.03,60.96 91.11,60.96 | 91.11,60.96 101.27,60.96 IC1.7 | 91.11,60.96 v91.11,62.23
  Bottom 0.127: IC1-5.24 100,107.95 95.56,107.95 95.56,109.22 93.65,109.22 93.65,93.34 90.48,90.17 v90.48,86.36 91.11,85.72 v91.11,62.23 | IC4.7 79.05,22.23 79.05,57.78 IC3.7
CADDR4  (via drill 0.25)
  Top 0.127: IC8.6 26.98,18.41 34.59,18.41 35.23,19.05 48.57,19.05 49.84,17.78 IC7.6 52.38,18.41 60,18.41 60.63,19.05 74.6,19.05 75.87,17.78 IC4.6 77.78,18.41 85.39,18.41 86.03,19.05 101.27,19.05 IC2.6 | IC1-5.25 102.54,100.33 v88.57,100.33 | IC5.6 26.98,57.78 34.59,57.78 35.23,58.42 49.2,58.42 50.47,57.15 IC6.6 52.38,57.78 60,57.78 60.63,58.42 74.6,58.42 75.87,57.15 IC3.6 77.78,57.78 85.39,57.78 86.03,58.42 89.84,58.42 | 89.84,58.42 99.36,58.42 100.64,57.15 IC1.6 | SV3.22 88.57,83.82 88.57,81.28 v89.2,81.28 | 89.84,58.42 v89.84,59.05
  Bottom 0.127: v88.57,100.33 87.94,99.69 87.94,85.72 SV3.22 | v89.2,81.28 89.84,80.64 v89.84,59.05 | IC4.6 79.68,20.32 79.68,59.69 78.41,60.96 75.23,60.96 75.23,59.05 IC3.6
CADDR5  (via drill 0.25)
  Top 0.127: IC8.5 26.98,15.88 34.59,15.88 35.23,16.51 49.2,16.51 50.47,15.24 IC7.5 52.38,15.88 60,15.88 60.63,16.51 74.6,16.51 75.87,15.24 IC4.5 77.78,15.88 85.39,15.88 86.03,16.51 101.27,16.51 IC2.5 | v92.38,102.87 v100,102.87 | IC5.5 26.98,55.24 34.59,55.24 35.23,55.88 49.2,55.88 50.47,54.61 IC6.5 52.38,55.24 60,55.24 60.63,55.88 74.6,55.88 75.87,54.61 IC3.5 77.78,55.24 80.31,55.24 | 80.31,55.24 85.39,55.24 86.03,55.88 v95.56,55.88 101.27,55.88 IC1.5 | SV3.24 90.48,85.72 91.11,85.72 91.75,86.36 95.56,86.36 96.19,85.72 96.19,81.28 v95.56,81.28 | 80.31,55.24 v80.31,53.98
  Bottom 0.127: v100,102.87 IC1-5.26 | v92.38,102.87 89.2,102.87 89.2,85.72 SV3.24 | v95.56,55.88 v95.56,81.28 | IC4.5 80.31,18.41 v80.31,53.98
CADDR6  (via drill 0.25)
  Top 0.127: IC8.4 26.98,13.34 34.59,13.34 35.23,13.97 49.2,13.97 50.47,12.7 IC7.4 52.38,13.34 60,13.34 60.63,13.97 74.6,13.97 75.87,12.7 IC4.4 77.78,13.34 85.39,13.34 86.03,13.97 101.27,13.97 IC2.4 | IC5.4 26.98,52.7 34.59,52.7 35.23,53.34 49.2,53.34 50.47,52.07 IC6.4 52.38,52.7 60,52.7 60.63,53.34 74.6,53.34 75.87,52.07 IC3.4 77.78,52.7 80.95,52.7 | IC1-5.27 102.54,95.25 97.46,95.25 v95.56,93.34 | 80.95,52.7 85.39,52.7 86.03,53.34 96.19,53.34 | 96.19,53.34 101.27,53.34 IC1.4 | SV3.26 93.65,83.82 v94.28,83.82 | 96.19,53.34 v96.19,55.24 | 80.95,52.7 v80.95,52.07
  Bottom 0.127: v95.56,93.34 94.92,92.71 94.92,90.81 93.65,89.53 91.11,89.53 91.11,87 92.38,85.72 SV3.26 | v94.28,83.82 95.56,83.82 96.19,83.19 v96.19,55.24 | IC4.4 80.95,16.51 v80.95,52.07
CADDR7  (via drill 0.25)
  Top 0.127: IC8.3 26.98,10.79 34.59,10.79 35.23,11.43 49.2,11.43 50.47,10.16 IC7.3 52.38,10.79 60,10.79 60.63,11.43 74.6,11.43 75.87,10.16 IC4.3 77.78,10.79 85.39,10.79 86.03,11.43 101.27,11.43 IC2.3 | IC1-5.28 100,90.17 v98.09,90.17 | IC5.3 26.98,50.16 34.59,50.16 35.23,50.8 38.41,50.8 39.68,49.53 IC6.3 53.01,49.53 54.28,50.8 63.17,50.8 63.81,50.16 76.5,50.16 IC3.3 78.41,49.53 79.68,50.8 81.59,50.8 | IC1.3 101.91,50.16 98.73,50.16 | 98.73,50.16 89.2,50.16 88.57,50.8 81.59,50.8 | 98.73,50.16 v98.73,51.44 | 81.59,50.8 v81.59,48.9
  Bottom 0.127: v98.09,90.17 94.92,87 SV3.28 96.19,85.09 96.19,84.45 96.83,83.82 98.09,83.82 98.73,83.19 v98.73,51.44 | IC4.3 81.59,14.61 v81.59,48.9
CADDR8  (via drill 0.25)
  Top 0.127: IC8.25 12.37,11.43 33.96,11.43 35.23,12.7 IC7.25 37.14,12.06 49.84,12.06 50.47,11.43 59.36,11.43 60.63,12.7 IC4.25 62.54,12.06 75.23,12.06 75.87,11.43 84.76,11.43 86.03,12.7 IC2.25 | IC1-5.1 111.43,86.36 98.73,86.36 SV3.30 | IC5.25 12.37,50.8 33.96,50.8 35.23,52.07 IC6.25 38.41,52.07 39.68,50.8 53.01,50.8 53.65,51.44 61.27,51.44 IC3.25 63.17,52.07 64.44,50.8 78.41,50.8 79.05,51.44 86.67,51.44 IC1.25 99.36,52.07 100.64,50.8 108.25,50.8 v112.06,54.61
  Bottom 0.127: IC1-5.1 112.7,92.71 112.7,69.22 112.06,68.58 v112.06,54.61 | IC2.25 84.76,15.24 84.76,49.53 IC1.25
CADDR9  (via drill 0.25)
  Top 0.127: IC8.24 12.37,13.97 33.96,13.97 35.23,15.24 IC7.24 37.14,14.61 49.84,14.61 50.47,13.97 59.36,13.97 60.63,15.24 IC4.24 62.54,14.61 75.23,14.61 75.87,13.97 84.76,13.97 86.03,15.24 IC2.24 | IC5.24 12.37,53.34 33.96,53.34 35.23,54.61 IC6.24 37.14,53.98 49.84,53.98 50.47,53.34 59.36,53.34 60.63,54.61 IC3.24 62.54,53.98 75.23,53.98 75.87,53.34 84.76,53.34 86.03,54.61 IC1.24 | IC1-5.2 108.89,93.98 106.35,93.98 v100.64,88.27 | v99.36,57.15 98.73,56.52 v89.2,56.52
  Bottom 0.127: v100.64,88.27 100,87.63 SV3.32 101.27,83.82 101.27,80.64 99.36,78.74 v99.36,57.15 | IC1.24 v89.2,56.52 | IC4.24 60,13.34 60,6.99 60.63,6.35 64.44,6.35 64.44,52.07 IC3.24
CADDR10  (via drill 0.25)
  Top 0.127: IC8.21 12.37,21.59 33.96,21.59 35.23,22.86 IC7.21 37.14,22.23 49.84,22.23 50.47,21.59 59.36,21.59 60.63,22.86 IC4.21 62.54,22.23 75.23,22.23 75.87,21.59 84.76,21.59 86.03,22.86 IC2.21 | IC5.21 12.37,60.96 33.96,60.96 35.23,62.23 IC6.21 37.14,61.59 49.84,61.59 50.47,60.96 59.36,60.96 60.63,62.23 IC3.21 62.54,61.59 75.23,61.59 75.87,60.96 84.76,60.96 86.03,62.23 IC1.21 | IC1-5.3 107.62,95.25 v105.08,95.25
  Route15 0.127: SV3.34 101.27,83.82 101.27,76.2 IC1.21
  Bottom 0.127: v105.08,95.25 101.91,95.25 101.91,85.72 SV3.34 | IC2.21 85.39,24.77 85.39,40.01 89.84,44.45 89.84,57.78 89.2,58.42 89.2,60.33 IC1.21
CADDR11  (via drill 0.25)
  Top 0.127: IC8.23 12.37,16.51 33.96,16.51 35.23,17.78 IC7.23 37.14,17.14 49.84,17.14 50.47,16.51 59.36,16.51 60.63,17.78 IC4.23 62.54,17.14 75.23,17.14 75.87,16.51 84.76,16.51 86.03,17.78 IC2.23 | IC5.23 12.37,55.88 33.96,55.88 35.23,57.15 IC6.23 37.14,56.52 49.84,56.52 50.47,55.88 59.36,55.88 60.63,57.15 IC3.23 62.54,56.52 75.23,56.52 75.87,55.88 84.76,55.88 86.03,57.15 IC1.23 | v106.98,97.16 IC1-5.4 | v111.43,76.2 103.81,68.58 89.84,68.58 v89.2,69.22
  Bottom 0.127: v106.98,97.16 105.72,95.89 105.72,92.71 105.08,92.08 SV3.36 106.35,83.82 111.43,83.82 v111.43,76.2 | v89.2,69.22 89.2,64.14 88.57,63.5 85.39,63.5 85.39,59.05 IC1.23 | IC4.23 59.36,15.24 59.36,5.08 60.63,3.81 65.08,3.81 65.08,53.98 IC3.23
CADDR12  (via drill 0.25)
  Top 0.127: IC5.2 26.98,47.62 34.59,47.62 35.23,48.26 49.2,48.26 50.47,46.99 IC6.2 52.38,47.62 60,47.62 60.63,48.26 74.6,48.26 75.87,46.99 IC3.2 77.78,47.62 85.39,47.62 86.03,48.26 101.27,48.26 IC1.2 v106.98,46.99 | IC8.2 26.98,8.26 34.59,8.26 35.23,8.89 48.57,8.89 49.84,7.62 IC7.2 52.38,8.26 60,8.26 60.63,8.89 74.6,8.89 75.87,7.62 IC4.2 77.78,8.26 85.39,8.26 86.03,8.89 101.27,8.89 IC2.2
  Bottom 0.127: IC1-5.5 108.25,100.97 108.25,92.71 107.62,92.08 107.62,86.36 | SV3.38 107.62,86.36 | 107.62,86.36 112.06,86.36 112.06,69.85 111.43,69.22 111.43,46.99 | 111.43,46.99 111.43,16.51 IC2.2 | 111.43,46.99 v106.98,46.99
CMEMSEL
  Top 0.127: IC5.26 12.37,48.26 33.96,48.26 35.23,49.53 IC6.26 37.14,48.9 49.84,48.9 50.47,48.26 59.36,48.26 60.63,49.53 IC3.26 62.54,48.9 75.23,48.9 75.87,48.26 84.76,48.26 86.03,49.53 IC1.26 | IC2.26 86.03,10.16 84.76,8.89 75.87,8.89 75.23,9.53 62.54,9.53 IC4.26 61.27,9.53 53.65,9.53 53.01,8.89 49.84,8.89 48.57,10.16 IC7.26 35.87,9.53 28.25,9.53 27.61,8.89 12.37,8.89 IC8.26 R3.1
  Bottom 0.127: IC5.26 9.2,47.62 9.2,15.88 R3.1
FAULT
  Top 0.127: IC10.17 31.42,133.99 30.79,133.99 30.79,144.15 53.01,144.15 54.91,146.05 66.98,146.05 FAULT.A
GND
  Top 0.127: JP3.P$6 JP3.P$5 | 14.91,139.7 18.72,135.89 IC10.22 | 14.91,139.7 UCODE.3 | 14.91,139.7 21.9,146.69 21.9,149.86 START.2 | PWR1.K 103.81,146.05 IC1-5.15
  Bottom 0.127: PWR1.K 103.81,148.59 JP3.P$6 | START.2 21.9,149.86 23.17,151.13 32.69,151.13 CPU-RESET.1
  pour Route2: 0.94,137.16 112.7,137.16 112.7,1.27 0.94,1.27
INT-EN  (via drill 0.25)
  Top 0.127: 88.57,79.38 v90.48,79.38 | 88.57,79.38 88.57,80.64 93.65,80.64 94.92,81.92 SV3.27 | v75.87,80.64 77.14,79.38 88.57,79.38
  Bottom 0.127: IC2.15 90.48,41.27 v90.48,79.38 | IC11.25 75.87,99.06 v75.87,80.64
INT-LD-HI  (via drill 0.25)
  Top 0.127: v93.02,81.28 91.11,81.28 SV3.23
  Route15 0.127: IC11.23 84.12,100.97 84.12,93.34 88.57,88.9 88.57,83.82 SV3.23
  Bottom 0.127: IC2.17 92.38,38.1 92.38,80.64 v93.02,81.28
INT-LD-LO  (via drill 0.25)
  Top 0.127: IC1.13 98.73,78.74 v89.2,78.74 | v83.49,85.72 83.49,83.82 86.03,83.82 SV3.21
  Bottom 0.127: v89.2,78.74 87.3,80.64 SV3.21 | IC11.6 84.12,104.78 84.12,92.71 84.76,92.08 84.76,87 v83.49,85.72
INT-START  (via drill 0.25)
  Top 0.127: v76.5,92.71 79.68,89.53 92.38,89.53 v93.65,88.27
  Route2 0.127: v93.65,88.27 93.65,83.82 SV3.25
  Bottom 0.127: IC2.16 91.75,40.01 91.75,81.92 SV3.25 | IC11.24 80.31,102.23 80.31,95.89 79.68,95.25 76.5,95.25 v76.5,92.71
IO-ADDR0  (via drill 0.25)
  Top 0.127: IC6.16 35.87,75.56 v31.42,75.56 | v75.87,113.67 75.87,115.57 v33.33,115.57
  Bottom 0.127: v31.42,75.56 30.79,76.2 30.79,81.28 30.15,81.92 30.15,83.19 28.88,84.45 SV1.22 28.88,95.25 30.15,96.52 30.15,112.39 v33.33,115.57 | IC13.5 75.87,106.68 v75.87,113.67
IO-ADDR1  (via drill 0.25)
  Top 0.127: v32.69,72.39 IC6.17 | v39.68,89.53 37.14,87 33.33,87 SV1.24
  Bottom 0.127: v32.69,72.39 32.69,83.19 31.42,84.45 SV1.24 | IC13.6 75.23,108.58 75.23,127.64 72.06,130.81 39.68,130.81 v39.68,89.53
IO-ADDR2  (via drill 0.25)
  Top 0.127: v40.31,88.9 37.77,86.36 35.23,86.36 SV1.26
  Route15 0.127: IC6.18 32.69,73.66 32.69,83.82 SV1.26
  Bottom 0.127: IC13.7 70.16,112.39 70.16,126.36 66.34,130.18 40.31,130.18 v40.31,88.9
IO-ADDR3  (via drill 0.25)
  Top 0.127: IC13.8 72.7,111.12 67.61,111.12 66.98,110.49 v37.14,110.49
  Bottom 0.127: IC6.19 34.59,69.22 34.59,81.28 35.23,81.92 35.23,83.82 SV1.28 36.5,109.86 v37.14,110.49
LD
  Top 0.127: IC10.19 26.34,145.41 30.15,145.41 33.96,149.22 49.84,149.22 LOADING.A
LD-INS-REG  (via drill 0.25)
  Top 0.127: v100,38.1 IC2.13 | v76.5,95.89 76.5,93.98 75.87,93.98 75.87,88.9 v91.75,88.9
  Bottom 0.127: v100,38.1 97.46,40.64 97.46,52.7 | SV3.29 97.46,52.7 | IC11.26 76.5,97.16 v76.5,95.89 | v91.75,88.9 93.65,87 93.65,56.52 97.46,52.7
N$1
  Bottom 0.127: R1.1 106.35,143.51 106.35,148.59 PWR1.A
N$6  (via drill 0.25)
  Top 0.127: v29.52,125.09 41.58,125.09 Q1.2 41.58,125.73 C11.2
  Bottom 0.127: v29.52,125.09 IC10.9
N$7
  Top 0.127: IC10.10 28.25,121.28 41.58,121.28 Q1.1 41.58,120.65 C12.2
N$8
  Top 0.127: C13.1 DTR-RESET.2
N$17
  Bottom 0.127: IC10.21 19.99,125.73 C14.2
N$25
  Bottom 0.127: READY.K R11.1
N$26
  Bottom 0.127: LOADING.K R16.1
N$27
  Bottom 0.127: FAULT.K R6.1
N$30
  Top 0.127: IC10.23 16.18,137.16 14.91,137.16 UCODE.2
N$32
  Top 0.127: IC9.7 11.1,96.52 JP4.2
N$33
  Bottom 0.127: JP3.P$1 DTR-RESET.1
N$34
  Top 0.127: JP3.P$4 FTDI-VCC.2
N$39
  Bottom 0.127: R25.1 33.96,116.84 32.69,118.11 32.69,139.7 25.71,146.69 | 25.71,146.69 25.71,149.86 START.1 | IC10.25 7.29,130.81 7.29,142.24 9.83,144.78 25.71,144.78 25.71,146.69
OPERAND-CLK  (via drill 0.25)
  Top 0.127: IC11.28 79.68,92.71 84.76,92.71 87.3,90.17 96.19,90.17 98.73,87.63 v102.54,87.63
  Bottom 0.127: v102.54,87.63 103.81,86.36 103.81,83.82 SV3.33 102.54,80.64 100.64,78.74 100.64,32.38 IC2.11
OUT-OFF
  Route15 0.127: IC12.7 94.28,104.78 94.28,93.98 91.11,90.81 91.11,81.92 89.84,80.64 81.59,80.64 SV3.15
  Bottom 0.127: IC3.12 75.23,70.48 75.23,66.67 75.87,66.04 79.68,66.04 SV3.15
OUT-ON  (via drill 0.25)
  Top 0.127: v80.95,69.85 IC3.11
  Route2 0.127: v93.02,93.98 93.02,93.34 86.03,86.36 86.03,84.45 85.39,83.82 83.49,83.82 SV3.17
  Bottom 0.127: v80.95,69.85 82.22,71.12 SV3.17 | IC12.8 93.02,111.76 v93.02,93.98
READY  (via drill 0.25)
  Top 0.127: IC10.18 28.88,144.78 42.85,144.78 46.66,148.59 59.36,148.59 READY.A
  Route2 0.127: v105.08,78.11 102.54,80.64 77.14,80.64 75.87,81.92 75.87,83.82 SV3.12
  Bottom 0.127: ROM.10 105.08,68.58 v105.08,78.11 | SV3.12 75.23,85.72 75.23,104.78 76.5,106.05 76.5,133.99 READY.A
REG-LD-ID0  (via drill 0.25)
  Top 0.127: IC5.18 13.01,71.75 v18.72,71.75 | IC14.27 52.38,95.89 25.71,95.89 19.99,90.17 19.99,82.55 SV1.15
  Bottom 0.127: v18.72,71.75 21.26,71.75 SV1.15
REG-LD-ID1  (via drill 0.25)
  Top 0.127: IC5.19 13.64,69.85 v23.8,69.85 | IC14.28 51.11,92.08 v25.71,92.08 | v22.53,85.72 22.53,82.55 SV1.17
  Bottom 0.127: SV1.17 v23.8,69.85 | v25.71,92.08 22.53,88.9 v22.53,85.72
REG-LD-ID2  (via drill 0.25)
  Top 0.127: v59.36,88.9 41.58,88.9 40.31,90.17 v25.71,90.17
  Bottom 0.127: IC8.11 24.44,32.38 24.44,80.64 25.07,81.28 | SV1.19 25.07,81.28 | IC14.1 59.36,92.71 v59.36,88.9 | v25.71,90.17 25.07,89.53 25.07,81.28
REG-LD-ID3  (via drill 0.25)
  Top 0.127: IC8.12 26.98,33.66 v28.88,33.66 | IC14.2 55.55,96.52 54.28,95.25 26.34,95.25 22.53,91.44 22.53,86.36 26.98,86.36 27.61,85.72 27.61,82.55 SV1.21
  Bottom 0.127: v28.88,33.66 30.15,34.92 30.15,80.64 28.88,81.92 SV1.21
REG-RD-ID0  (via drill 0.25)
  Top 0.127: IC5.13 25.71,75.56 20.62,75.56 16.18,80.01 13.64,80.01 SV1.7 | v29.52,106.68 IC14.23
  Bottom 0.127: v29.52,106.68 18.72,95.89 18.72,91.44 13.64,86.36 12.37,86.36 12.37,83.82 SV1.7
REG-RD-ID1  (via drill 0.25)
  Top 0.127: IC14.24 52.38,103.5 22.53,103.5 21.26,102.23 v10.46,102.23
  Bottom 0.127: 12.37,78.74 13.64,80.01 SV1.9 | 12.37,78.74 IC5.15 | v10.46,102.23 9.83,101.6 9.83,81.28 12.37,78.74
REG-RD-ID2  (via drill 0.25)
  Top 0.127: v16.18,74.93 IC5.16 | v49.84,98.42 47.93,96.52 21.26,96.52 18.72,93.98 18.72,86.36 18.09,86.36 17.45,85.72 17.45,82.55 SV1.11
  Bottom 0.127: SV1.11 v16.18,74.93 | v49.84,98.42 IC14.25
REG-RD-ID3  (via drill 0.25)
  Top 0.127: IC5.17 12.37,73.66 v16.18,73.66 | v25.71,99.06 IC14.26
  Bottom 0.127: 17.45,74.93 18.72,76.2 SV1.13 | 17.45,74.93 v16.18,73.66 | v25.71,99.06 21.26,94.61 21.26,89.53 17.45,85.72 17.45,74.93
SCL  (via drill 0.25)
  Top 0.127: 61.9,123.19 IC14.12 | 72.06,123.19 61.9,123.19 | IC13.12 72.06,123.19 | 84.76,123.19 IC11.12 | 72.06,123.19 84.76,123.19 | 97.46,123.19 IC12.12 | 84.76,123.19 97.46,123.19 | IC1-5.12 110.16,123.19 97.46,123.19 | v27.61,121.92 28.25,122.56 51.11,122.56 51.74,123.19 61.9,123.19
  Bottom 0.127: R5.1 2.21,110.49 2.21,111.76 | 2.21,111.76 2.21,125.73 IC10.28 | IC9.6 27.61,110.49 28.88,110.49 28.88,111.76 27.61,111.76 | 2.21,111.76 27.61,111.76 | v27.61,121.92 27.61,111.76
SDA
  Top 0.127: IC9.5 17.45,97.79 13.64,97.79 11.1,95.25 6.02,95.25 3.48,97.79 R12.1 0.94,107.95 0.94,125.09 4.12,125.09 IC10.27 8.56,124.46 50.47,124.46 51.74,125.73 61.9,125.73 | 61.9,125.73 IC14.13 | 72.06,125.73 61.9,125.73 | IC13.13 72.06,125.73 | 84.76,125.73 IC11.13 | 72.06,125.73 84.76,125.73 | 97.46,125.73 IC12.13 | 84.76,125.73 97.46,125.73 | IC1-5.13 110.16,125.73 97.46,125.73
SOFT-HALT  (via drill 0.25)
  Top 0.127: IC12.6 97.46,105.41 v73.33,105.41
  Bottom 0.127: IC3.13 73.33,78.74 73.33,83.19 72.7,83.82 70.16,83.82 70.16,84.45 SV3.8 72.06,87.63 72.06,92.08 71.42,92.71 71.42,105.41 v73.33,105.41
SPARE1  (via drill 0.25)
  Top 0.127: IC2.18 74.6,43.18 v58.73,43.18
  Route15 0.127: IC11.22 75.23,106.05 75.23,93.34 69.52,87.63 58.73,87.63 56.82,85.72 56.82,83.82 JP1.1
  Bottom 0.127: v58.73,43.18 55.55,46.35 JP1.1
SPARE2  (via drill 0.25)
  Top 0.127: IC1.11 103.17,70.48 104.45,70.48 113.34,79.38 113.34,113.03 87.3,113.03 | IC11.8 87.3,113.03 | 87.3,113.03 v55.55,113.03
  Bottom 0.127: JP1.2 53.65,87 53.65,90.81 51.11,93.34 51.11,97.16 51.74,97.79 55.55,97.79 v55.55,113.03
UCODE-COUNT-RESET  (via drill 0.25)
  Top 0.127: v104.45,80.64 103.81,81.28 101.27,81.28 SV3.31 | IC11.27 79.68,95.25 v94.92,95.25
  Bottom 0.127: IC2.12 106.35,36.83 106.35,52.7 108.89,55.24 108.89,76.2 v104.45,80.64 | v94.92,95.25 98.73,91.44 98.73,84.45 100,83.19 SV3.31
VCC
  Bottom 0.127: UCODE.1 20.62,128.91 21.9,128.91 IC10.20 | FTDI-VCC.1 103.81,132.08 R1.2
  pour Route15: 0.94,1.27 0.94,137.16 112.7,137.16 112.7,1.27
VPGM
  Top 0.127: IC8.1 27.61,3.81 50.47,3.81 | IC7.1 50.47,3.81 | 75.87,3.81 IC4.1 | 50.47,3.81 75.87,3.81 | IC2.1 101.27,3.81 75.87,3.81 | IC5.1 26.98,43.81 34.59,43.81 35.23,43.18 47.93,43.18 49.2,44.45 IC6.1 52.38,45.09 60,45.09 60.63,45.72 73.97,45.72 75.23,44.45 IC3.1 78.41,43.18 101.27,43.18 IC1.1
  Bottom 0.127: ROM.8 105.08,60.96 105.08,46.99 IC1.1 | IC8.1 28.25,6.99 28.25,42.55 IC5.1

## Text on the board
tNames: DOWN / LOAD | WRITE / MEM | WP | YACC1 SEQUENCER MEMORY BOARD 2.0 | www.onepagecomputer.com